# Altium project VLC_TX.PrjPcb
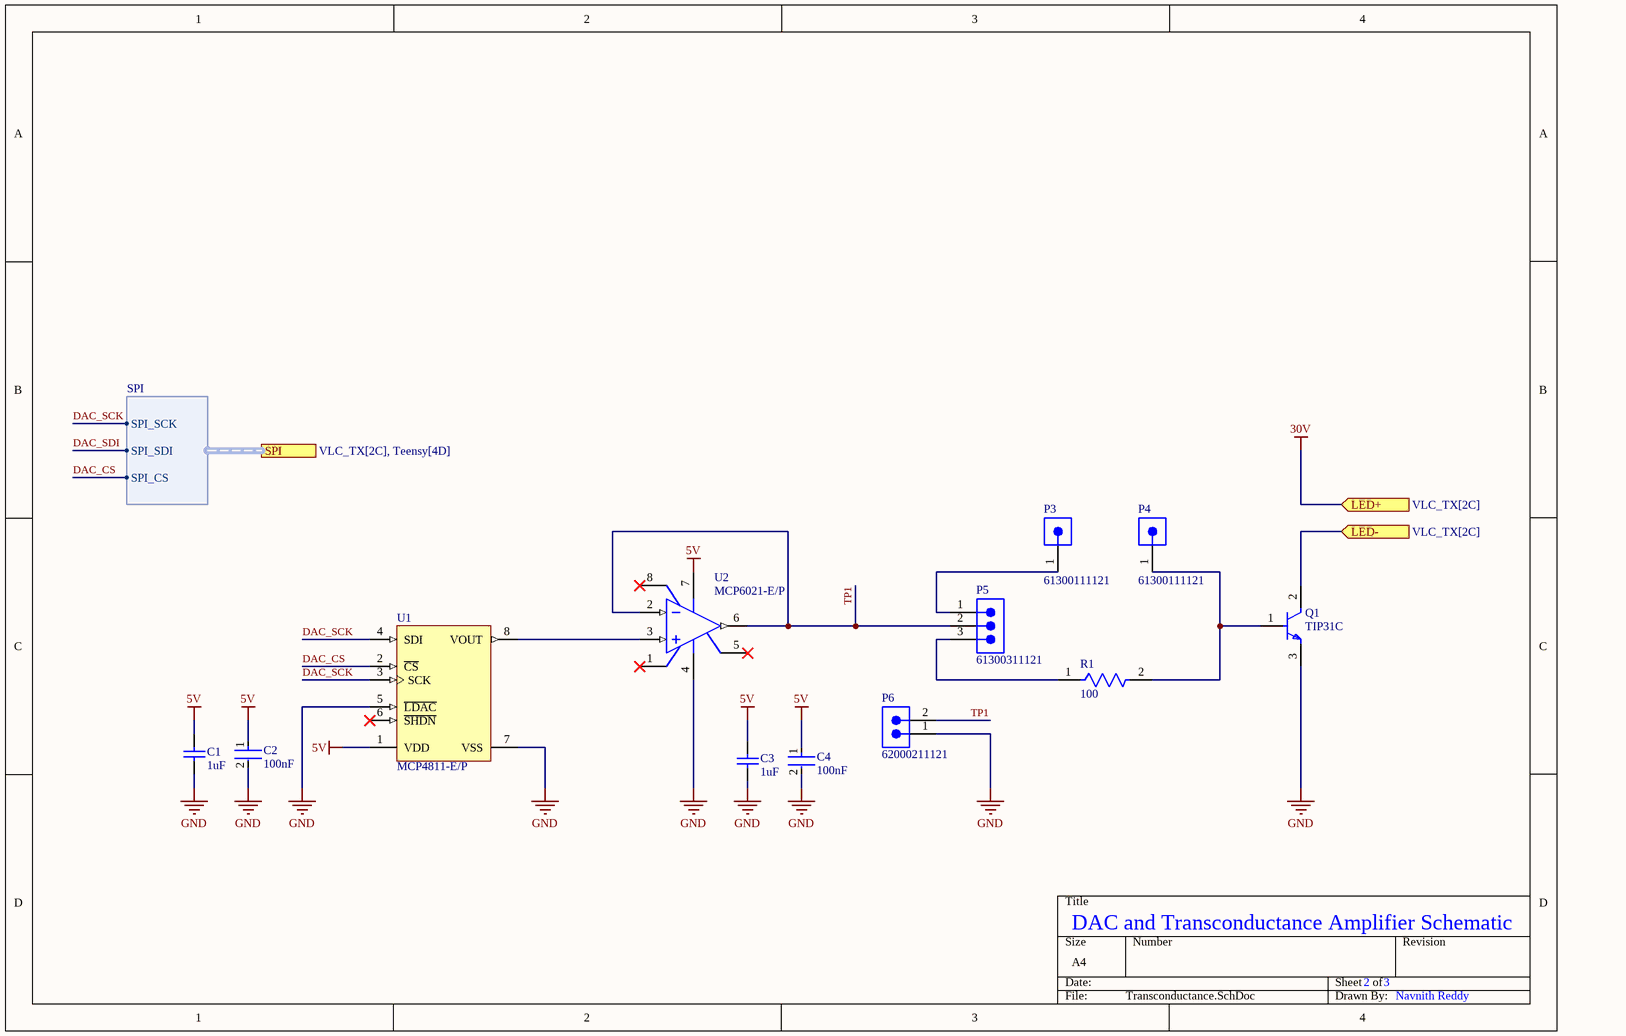
[diagram p0: Transconductance.SchDoc]
2 sheets, 15 parts. Net scope: flat (ports and power ports of the same name join across sheets).
Board file: VLC_TX.PcbDoc
Sheets:
  Transconductance.SchDoc
  Teensy.SchDoc

## Sheet Transconductance.SchDoc
size A4; SheetNumber: 2; SheetTotal: 3

### Parts
C1  1uF  [CAPC2013X145X50LL20T25]
C2  100nF  [FP-C0805C-DN-MFG]
C3  1uF  [CAPC2013X145X50LL20T25]
C4  100nF  [FP-C0805C-DN-MFG]
P3  61300111121  [61300111121]
P4  61300111121  [61300111121]
P5  61300311121  [61300311121]
P6  62000211121  [62000211121]
Q1  TIP31C  [FP-TO-220-P0A0015988-MFG]
R1  100  [FP-TNPW0805-e3-MFG]
U1  MCP4811-E/P  [PDIP300-P8]
U2  MCP6021-E/P  [PDIP300-P8]

### Ports
LED+ (in, see VLC_TX[2C]), LED- (in, see VLC_TX[2C]), SPI (harness SPI, see VLC_TX[2C], Teensy[4D])

### Harnesses
SPI: SPI_SCK, SPI_SDI, SPI_CS

### Nets
5V: C1.2 C2.1 C3.2 C4.1 U1.1(VDD) U2.7(VDD)
30V: port LED+
GND: C1.1 C2.2 C3.1 C4.2 P6.1 Q1.3(E) U1.5(~{LDAC}) U1.7(VSS) U2.4(VSS)
DAC_CS: U1.2(~{CS}) ; port SPI.SPI_CS  [project net 10]
DAC_SCK: U1.3(SCK) U1.4(SDI) ; port SPI.SPI_SCK  [project net 13]
TP1: P5.2 P6.2 U2.2(VIN-) U2.6(VOUT)
NetP3_1: P3.1 P5.1
NetP4_1: P4.1 Q1.1(B) R1.2
NetP5_3: P5.3 R1.1
NetQ1_2: Q1.2(C) ; port LED-
NetU1_8: U1.8(VOUT) U2.3(VIN+)

Not connected (* = marked no-connect by the designer): U1 6(~{SHDN})*; U2 1(NC)* 5(VREF)* 8(NC)*

### Notes on the sheet
- DAC and Transconductance Amplifier Schematic
- 2
- 3
- Navnith Reddy

### Library data of the parts
C1 C3 = CMP-1036-04746-2: Manufacturer: Kemet; Part Number: C0805C105K4PACTU
C2 C4 = CMP-2007-00274-2: CAP CER 0.1UF 16V X7R 0805; Manufacturer Part Number: C0805C104K4RACTU; Manufacturer: KEMET; Material: Ceramic; Tolerance: 0.1; Description: C0805 0.10 μF X7R 30ppm/°C 10.00% 16 V; Capacitance: 0.10 μF; Value: 0.10 μF; Temperature Coefficient: 30ppm/°C; Device Class L3: Ceramic Capacitors; RoHS: TRUE; Octopart: https://octopart.com/c0805c104k4ractu-kemet-92155; ComponentLink2Description: Datasheet; ComponentLink2URL: https://content.kemet.com/datasheets/KEM_C1003_C0G_SMD.pdf; Temperature Range High: +125°C; Category: Cap; Lead Free: Yes; Digikey Description: CAP CER 0.1UF 16V X7R 0805; Automotive: No; Temperature Range Low: -55°C; Voltage Rating: 16 V; Package: C0805C-DN; Ipc Land Pattern Name: CAPC200125X78; Height: 0.88mm; Device Class L1: Passive Components; Temperature: -55°C to +125°C; Mouser Description: Multilayer Ceramic Capacitors MLCC - SMD/SMT 16volts 0.1uF X7R 10%; Device Class L2: Capacitors; Temperature Characteristic: X7R
P3 P4 = CMP-1502-01058-2: NexarPartId: 32855518; Operating Supply Voltage: 250V; Connector Type: Male Pin; Contact Resistance: 20mΩ; Number of Contacts: 1; Gender: Male; Current Rating: 3A; Contact Mating Length: 5.9944mm; Number of Pins: 1; Lead Pitch: 2.54mm; Contact Plating: Gold; RoHS: Compliant; Termination: Solder; Mount: Through Hole; Number of Rows: 1; Orientation: Vertical; Contact Material: Copper; Packaging: Bulk; REACH SVHC: Unknown; Number of Positions: 1; Color: Black
P5 = CMP-1502-01062-2: NexarPartId: 32855521; Voltage Rating: 250V; Current Rating: 3A; Connector Type: Male Pin; Number of Positions: 3; Gender: Male; Contact Resistance: 20mΩ; Pitch: 2.54mm; Max Operating Temperature: 105°C; Lead Pitch: 2.54mm; Lead Free: Lead Free; Contact Mating Length: 5.9944mm; Contact Material: Copper; Number of Pins: 3; Orientation: Vertical; Height: 8.94mm; Packaging: Bulk; Min Operating Temperature: -40°C; Mount: Through Hole; RoHS: Compliant; Number of Contacts: 3; Operating Supply Voltage: 250V; Termination: Solder; Number of Rows: 1; Contact Plating: Gold; Color: Black; REACH SVHC: Unknown
P6 = CMP-1502-00956-3: NexarPartId: 61924778; Number of Contacts: 2; Voltage Rating: 200V; Gender: Male; Contact Resistance: 20mΩ; Current Rating: 2A; Lead Pitch: 2mm; Max Operating Temperature: 105°C; Contact Material: Gold; Number of Rows: 1; Operating Supply Voltage: 200V; Number of Pins: 2; Orientation: Vertical; Min Operating Temperature: -40°C; Height: 6.35mm; RoHS: Non-Compliant
Q1 = CMP-12195-000001-1: TRANS NPN 100V 3A TO-220; Manufacturer: STMicroelectronics; Hfe Max: 50; Number Of Npn: 1; Max Junction Temp: +150°C; Standoff Height: 3.5mm; Emitter Base Voltage: 5V; Collector Emitter Saturation Voltage: 1.2V; Power Dissipation: 2W; Hfe Testvce: 4V; Hfe Min: 10; Device Class L2: Transistors; ComponentLink2URL: https://www.st.com/resource/en/datasheet/tip31c.pdf; Device Class L1: Discrete Semiconductors; Digikey Description: TRANS NPN 100V 3A TO-220; Max Collector Current: 3A; RoHS: TRUE; Height: 19.68mm; Mouser Description: Bipolar Transistors - BJT NPN Gen Pur Power; Number Of Elements: 1; Package: TO-220-P0A0015988; Temperature: to +150°C; Octopart: https://octopart.com/tip31c-stmicroelectronics-15555; Manufacturer Part Number: TIP31C; Category: Trans; Hfe Testic: 3A; Lead Free: Yes; Collector Base Voltage: 100V; Device Class L3: BJTs; Collector Emitter Voltage: 100V; Automotive: No; ComponentLink2Description: Datasheet; Temperature Range High: +150°C
R1 = CMP-2001-04723-2: NexarPartId: 42014021; Working Voltage: 150V; Power Rating: 125mW; Voltage Rating (DC): 100V; Temperature Coefficient: 25ppm/°C; Resistance: 100Ω; Tolerance: 1%; Case Code (Metric): 2012; Max Operating Temperature: 125°C; Schedule B: 8533210045, 8533210045; Military Standard: Not; Case Code (Imperial): 0805; Voltage Rating: 150V; Number of Terminations: 2; REACH SVHC: No SVHC; Weight: 5.499807mg; Lead Free: Lead Free; Radiation Hardening: No; RoHS: Compliant; Termination: SMD/SMT; Min Operating Temperature: -55°C; Width: 1.2mm; Height: 450µm; Contact Plating: Tin; Composition: Thin Film; Packaging: Cut Tape; Length: 2mm; Depth: 1.25mm; Case/Package: 0805; Number of Pins: 2
U1 = CMP-0188-01069-1: 10-Bit DACs with Internal VREF and SPI Interface, 8-Pin PDIP, Extended Temperature; ComponentLink3Description: Package Specification; ComponentLink2Description: Datasheet; Code_JEDEC: MS-001; ComponentLink1Description: Manufacturer URL; ComponentLink3URL: http://www.microchip.com/stellent/groups/techpub_sg/documents/packagingspec/en012702.pdf; ComponentLink1URL: http://www.microchip.com/; DatasheetVersion: revB, Apr-2010; PackageReference: PDIP300-P8; PackageVersion: revBB, Aug-2009; ComponentLink2URL: http://ww1.microchip.com/downloads/en/DeviceDoc/22244B.pdf; PackageDescription: 8-Lead Plastic Dual In-Line (P) - 300 mil Body [PDIP]
U2 = CMP-0187-00675-2: None; Common Mode Rejection Ratio: 70dB; Number of Channels: 1; Power Supply Rejection Ratio (PSRR): 74dB; Min Supply Voltage: 2.5V; Input Offset Voltage (Vos): 250uV; Operating Supply Current: 1mA; Bandwidth: 10MHz; Amplifier Type: GENERAL PURPOSE; Output Current per Channel: 30mA; Max Supply Voltage: 5.5V; Input Bias Current: 1pA; Voltage Gain: 110dB; Output Current: 22mA; Slew Rate: 7V/µs; Lead Free: Lead Free; Technology: CMOS; Height: 0.195inch; REACH SVHC: No SVHC; Length: 0.4inch; Packaging: Rail/Tube; Package Quantity: 60; Mount: Through Hole; Max Operating Temperature: 125°C; RoHS Compliant: Yes; Number of Elements: 1; Harmonic Distortion: 0.00053%; Case/Package: PDIP; Radiation Hardening: No; Nominal Supply Current: 1mA; Number of Circuits: 1; Number of Pins: 8; Width: 0.28inch; Supply Current: 1mA; Gain Bandwidth Product: 10MHz; Number of Amplifiers: 1; Min Operating Temperature: -40°C; Unity Gain Bandwidth Product: 10MHz

## Sheet Teensy.SchDoc
size A4; SheetNumber: 3; SheetTotal: 3
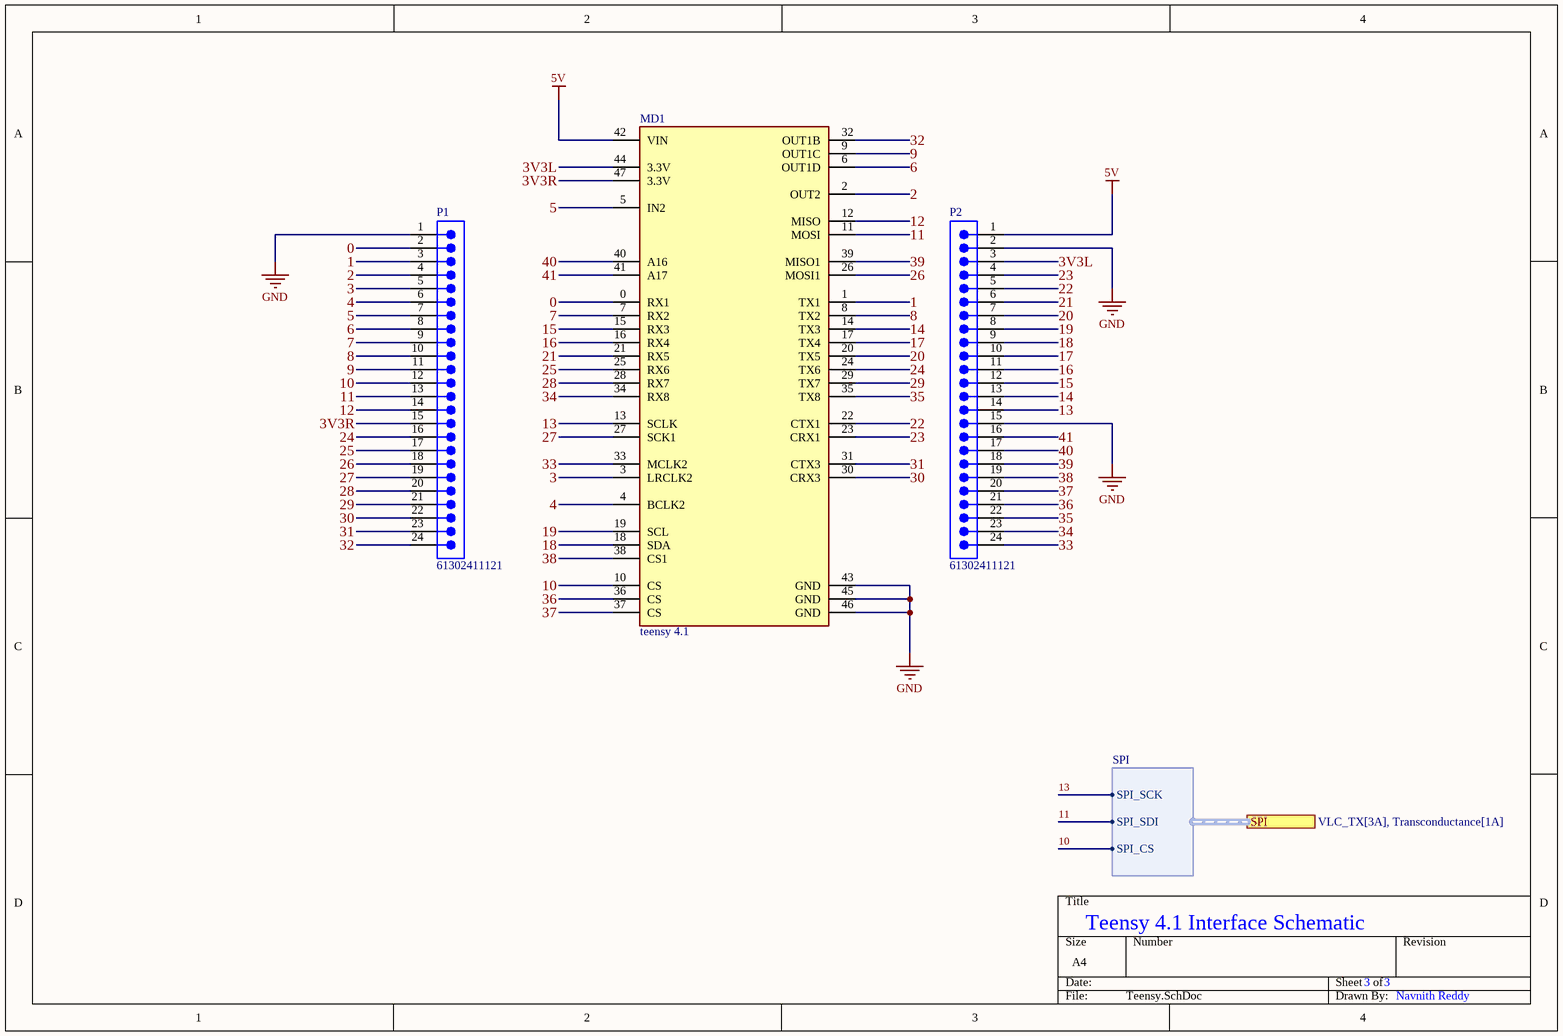
[diagram p1: Teensy.SchDoc]

### Parts
MD1  teensy 4.1  [FP-DEV-16996-MFG]
P1  61302411121  [61302411121]
P2  61302411121  [61302411121]

### Ports
SPI (harness SPI, see VLC_TX[3A], Transconductance[1A])

### Harnesses
SPI: SPI_SCK, SPI_SDI, SPI_CS

### Nets
5V: MD1.42(VIN) P2.1
GND: MD1.43(GND) MD1.45(GND) MD1.46(GND) P1.1 P2.2 P2.15
0: MD1.0(RX1) P1.2
1: MD1.1(TX1) P1.3
2: MD1.2(OUT2) P1.4
3: MD1.3(LRCLK2) P1.5
3V3L: MD1.44(3.3V) P2.3
3V3R: MD1.47(3.3V) P1.15
4: MD1.4(BCLK2) P1.6
5: MD1.5(IN2) P1.7
6: MD1.6(OUT1D) P1.8
7: MD1.7(RX2) P1.9
8: MD1.8(TX2) P1.10
9: MD1.9(OUT1C) P1.11
10: MD1.10(CS) P1.12 ; port SPI.SPI_CS
11: MD1.11(MOSI) P1.13 ; port SPI.SPI_SDI
12: MD1.12(MISO) P1.14
13: MD1.13(SCLK) P2.14 ; port SPI.SPI_SCK
14: MD1.14(TX3) P2.13
15: MD1.15(RX3) P2.12
16: MD1.16(RX4) P2.11
17: MD1.17(TX4) P2.10
18: MD1.18(SDA) P2.9
19: MD1.19(SCL) P2.8
20: MD1.20(TX5) P2.7
21: MD1.21(RX5) P2.6
22: MD1.22(CTX1) P2.5
23: MD1.23(CRX1) P2.4
24: MD1.24(TX6) P1.16
25: MD1.25(RX6) P1.17
26: MD1.26(MOSI1) P1.18
27: MD1.27(SCK1) P1.19
28: MD1.28(RX7) P1.20
29: MD1.29(TX7) P1.21
30: MD1.30(CRX3) P1.22
31: MD1.31(CTX3) P1.23
32: MD1.32(OUT1B) P1.24
33: MD1.33(MCLK2) P2.24
34: MD1.34(RX8) P2.23
35: MD1.35(TX8) P2.22
36: MD1.36(CS) P2.21
37: MD1.37(CS) P2.20
38: MD1.38(CS1) P2.19
39: MD1.39(MISO1) P2.18
40: MD1.40(A16) P2.17
41: MD1.41(A17) P2.16

### Notes on the sheet
- Teensy 4.1 Interface Schematic
- 3
- Navnith Reddy

### Library data of the parts
MD1 = CMP-157412-000001-1: TEENSY 4.1 (HEADERS)
P1 P2 = CMP-1502-01109-2: NexarPartId: 32855561; Number of Contacts: 24; Connector Type: Male Pin; Operating Supply Voltage: 250V; Pitch: 2.54mm; Gender: Male; Current Rating: 3A; Contact Resistance: 20mΩ; Mount: Through Hole; Contact Plating: Gold; Lead Pitch: 2.54mm; Orientation: Vertical; Color: Black; Packaging: Bulk; REACH SVHC: Unknown; Termination: Solder; Number of Positions: 24; RoHS: Compliant; Contact Mating Length: 5.9944mm; Number of Pins: 24; Contact Material: Copper; Number of Rows: 1

## Nets that join several sheets
5V: Transconductance (6 pins), Teensy (MD1.42 P2.1)
GND: Transconductance (9 pins), Teensy (6 pins)
10: Transconductance (U1.2), Teensy (MD1.10 P1.12)
13: Transconductance (U1.3 U1.4), Teensy (MD1.13 P2.14)